# EAGLE design Mainsnode_v2_wifi (EAGLE 6.3)
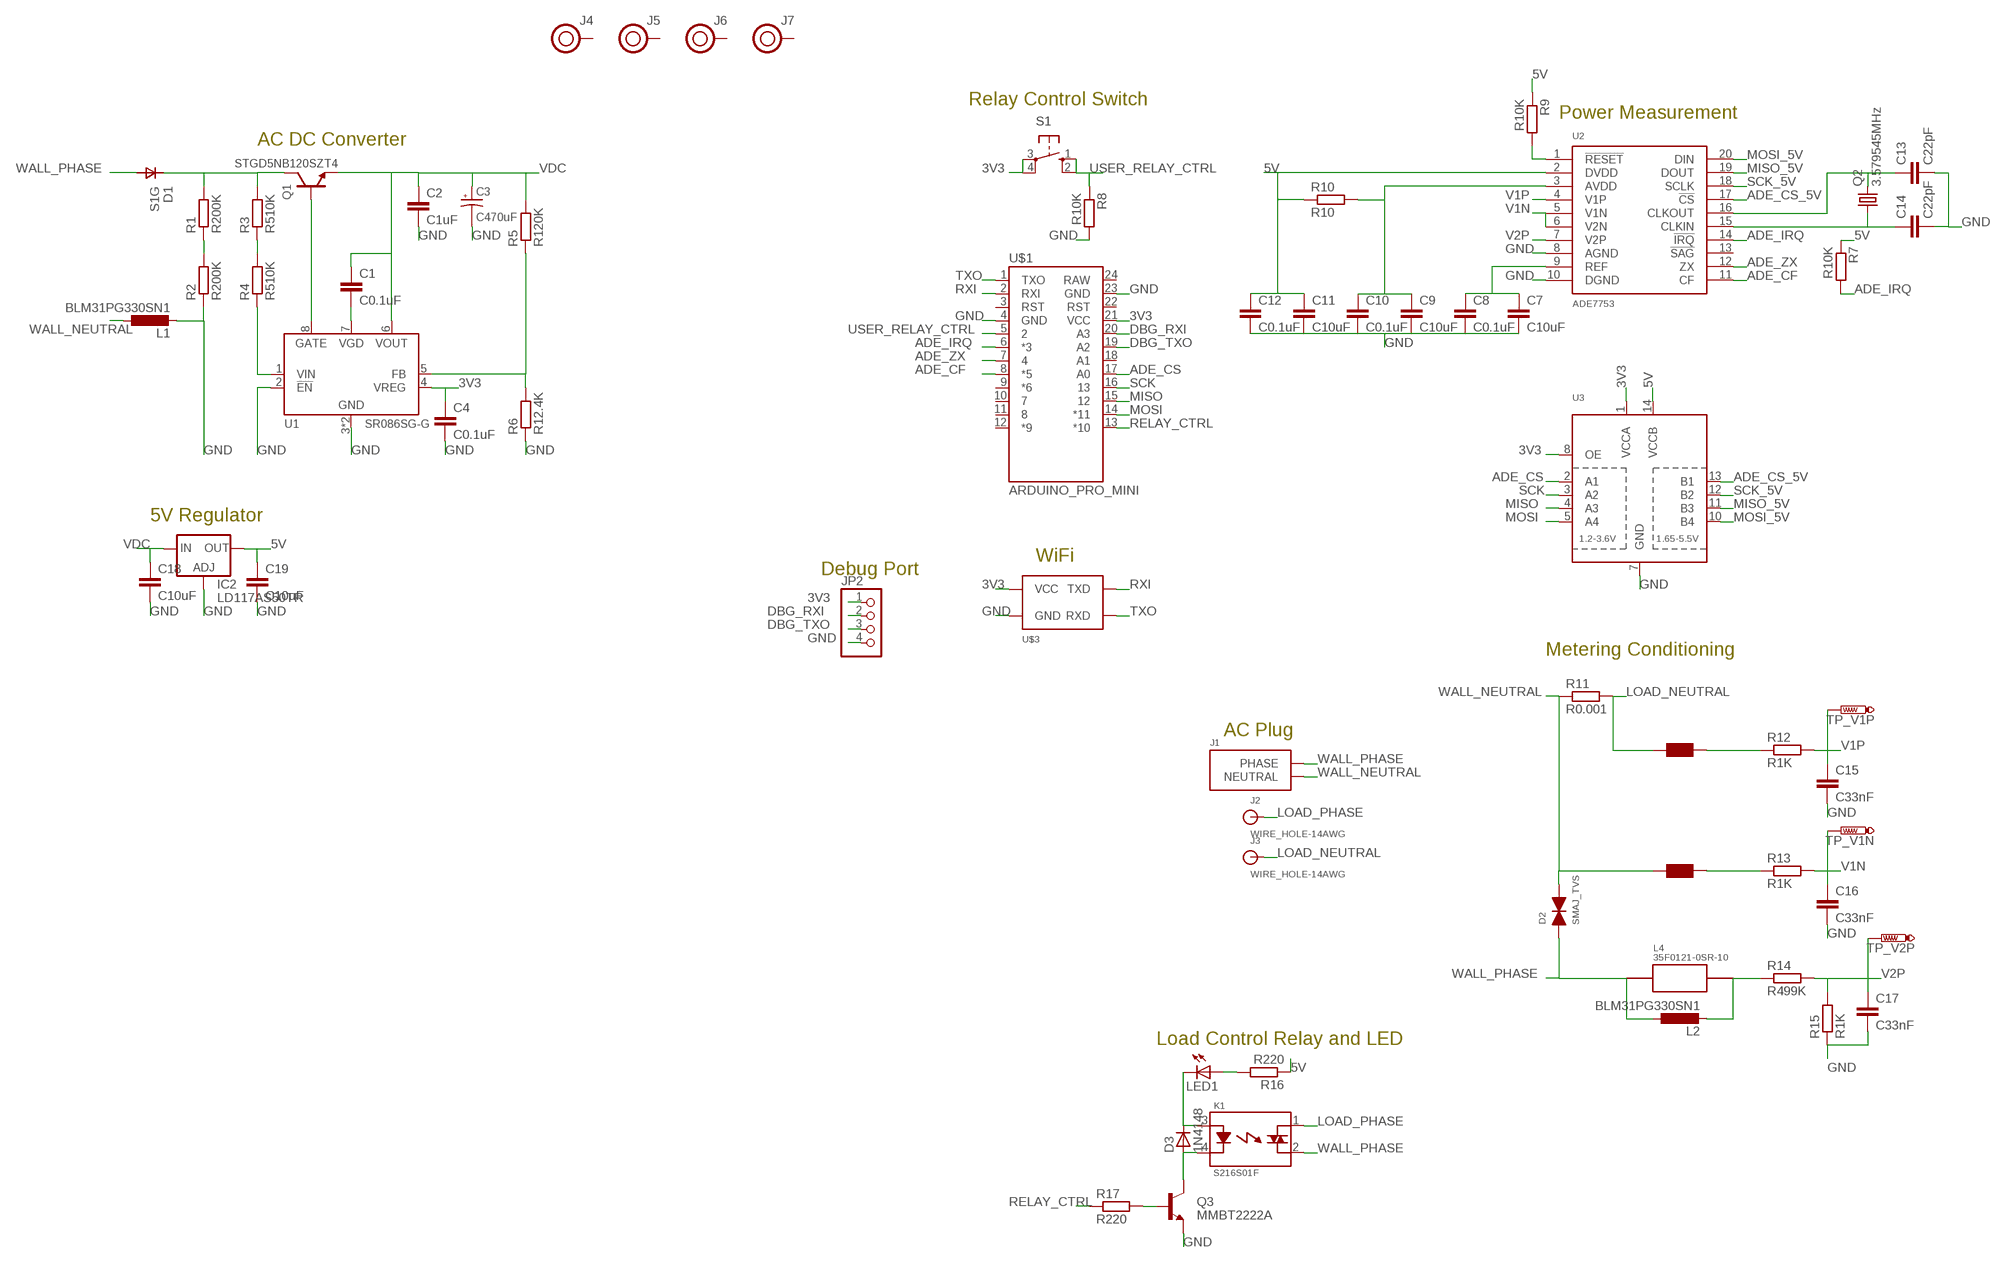
[diagram p0: schematic, sheet 1]

## Parts
C1  C0.1uF  C-EUC0805  [C0805]
C2  C1uF  C-EUC0805  [C0805]
C3  C470uF  CAP_EEE-FP1E471AP  [CAP_SM_10MM]
C4  C0.1uF  C-EUC0805  [C0805]
C7  C10uF  C-EUC0805  [C0805]
C8  C0.1uF  C-EUC0805  [C0805]
C9  C10uF  C-EUC0805  [C0805]
C10  C0.1uF  C-EUC0805  [C0805]
C11  C10uF  C-EUC0805  [C0805]
C12  C0.1uF  C-EUC0805  [C0805]
C13  C22pF  C-EUC0805  [C0805]
C14  C22pF  C-EUC0805  [C0805]
C15  C33nF  C-EUC0805  [C0805]
C16  C33nF  C-EUC0805  [C0805]
C17  C33nF  C-EUC0805  [C0805]
C18  C10uF  C-EUC0805  [C0805]
C19  C10uF  C-EUC0805  [C0805]
D1  S1G  [DO-214AC]
D2  SMAJ_TVS  [DO214_TVS]
D3  1N4148  D-SOD-80  [SOD80]
IC2  LD117AS50TR  [SOT223]
J1  AC-PLUG-2  [AC_MALE_PINS_2]
J2  WIRE_HOLE-14AWG  [WIRE_HOLE-14AWG]
J3  WIRE_HOLE-14AWG  [WIRE_HOLE-14AWG]
J4  HOLE  [HOLE-0.125]
J5  HOLE  [HOLE-0.125]
J6  HOLE  [HOLE-0.125]
J7  HOLE  [HOLE-0.125]
JP2  PINHD-1X4  [1X04]
K1  S216S01F  [RELAY_SX16S0X]
L1  BLM31PG330SN1  L-EUL3216C  [L3216C]
L2  BLM31PG330SN1  L-EUL3216C  [L3216C]
L4  35F0121-0SR-10  [35F0102]
LED1  LED3MM  [LED3MM]
Q1  STGD5NB120SZT4  [DPAK]
Q2  3.579545MHz  CRYSTALHC49S  [HC49/S]
Q3  MMBT2222A  TRANSISTOR_NPNMMBT2222A  [SOT23-3]
R1  R200K  R-EU_M0805  [M0805]
R2  R200K  R-EU_M0805  [M0805]
R3  R510K  R-EU_M0805  [M0805]
R4  R510K  R-EU_M0805  [M0805]
R5  R120K  R-EU_M0805  [M0805]
R6  R12.4K  R-EU_M0805  [M0805]
R7  R10K  R-EU_R0805  [R0805]
R8  R10K  R-EU_R0805  [R0805]
R9  R10K  R-EU_R0805  [R0805]
R10  R10  R-EU_R0805  [R0805]
R11  R0.001  R-EU_R2512  [R2512]
R12  R1K  R-EU_R0805  [R0805]
R13  R1K  R-EU_R0805  [R0805]
R14  R499K  R-EU_R0805  [R0805]
R15  R1K  R-EU_R0805  [R0805]
R16  R220  R-EU_R0805  [R0805]
R17  R220  R-EU_R0805  [R0805]
S1  10-XX  [B3F-10XX]
TP_V1N  PTR1PAD1-13  [P1-13]
TP_V1P  PTR1PAD1-13  [P1-13]
TP_V2P  PTR1PAD1-13  [P1-13]
U1  SR086SG-G  [SR086]
U2  ADE7753  [SSOP-20]
U3  TXB0104PWR  [TSSOP14]
U$1  ARDUINO_PRO_MINI  [ARDUINO_PRO_MINI]
U$3  ESP8266  [ESP8266]
U$4  BLM18BB151SN1  L0603  [L0603]
U$5  BLM18BB151SN1  L0603  [L0603]

## Nets
3V3: C4.1 JP2.1 S1.3(P) S1.4(P1) U1.4(VREG) U3.1(VCCA) U3.8(OE) U$1.21(VCC) U$3.VCC
5V: C11.1 C12.1 C19.1 IC2.4(OUT) R7.1 R9.1 R10.1 R16.1 U2.2(DVDD) U3.14(VCCB)
ADE_CF: U2.11(CF) U$1.8(*5)
ADE_CS: U3.2(A1) U$1.17(A0)
ADE_CS_5V: U2.17(!CS) U3.13(B1)
ADE_IRQ: R7.2 U2.14(!IRQ) U$1.6(*3)
ADE_ZX: U2.12(ZX) U$1.7
DBG_RXI: JP2.2 U$1.20(A3)
DBG_TXO: JP2.3 U$1.19(A2)
GND: C2.2 C3.- C4.2 C7.2 C8.2 C9.2 C10.2 C11.2 C12.2 C13.2 C14.2 C15.2 C16.2 C17.2 C18.2 C19.2 IC2.1(ADJ) JP2.4 L1.2 Q3.2(E) R2.1 R6.1 R8.2 R15.1 U1.2(!EN) U1.3(GND) U1.PAD(GND) U2.8(AGND) U2.10(DGND) U3.7(GND) U$1.4(GND) U$1.23(GND) U$3.GND
LOAD_NEUTRAL: J3.P$1 R11.2 U$4.1
LOAD_PHASE: J2.P$1 K1.1
MISO: U3.4(A3) U$1.15
MISO_5V: U2.19(DOUT) U3.11(B3)
MOSI: U3.5(A4) U$1.14(*11)
MOSI_5V: U2.20(DIN) U3.10(B4)
N$1: D1.CATHODE Q1.P$2(C) R1.2 R3.2
N$2: R1.1 R2.2
N$3: R3.1 R4.2
N$4: Q1.P$1(G) U1.8(GATE)
N$5: R4.1 U1.1(VIN)
N$6: C1.2 U1.7(VGD)
N$7: R5.1 R6.2 U1.5(FB)
N$8: LED1.A R16.2
N$9: R9.2 U2.1(!RESET)
N$10: C7.1 C8.1 U2.9(REF)
N$11: C14.1 Q2.1 U2.15(CLKIN)
N$12: C13.1 Q2.2 U2.16(CLKOUT)
N$13: C9.1 C10.1 R10.2 U2.3(AVDD)
N$14: R12.1 U$4.2
N$15: R13.1 U$5.2
N$16: D3.1(C) K1.3 LED1.K(C)
N$17: L2.2 L4.2 R14.1
N$18: D3.2(A) K1.4 Q3.3(C)
N$19: Q3.1(B) R17.2
RELAY_CTRL: R17.1 U$1.13(*10)
RXI: U$1.2(RXI) U$3.TXD
SCK: U3.3(A2) U$1.16
SCK_5V: U2.18(SCLK) U3.12(B2)
TXO: U$1.1(TXO) U$3.RXD
USER_RELAY_CTRL: R8.1 S1.1(S) S1.2(S1) U$1.5
V1N: C16.1 R13.2 TP_V1N.TP U2.5(V1N) U2.6(V2N)
V1P: C15.1 R12.2 TP_V1P.TP U2.4(V1P)
V2P: C17.1 R14.2 R15.2 TP_V2P.TP U2.7(V2P)
VDC: C1.1 C2.1 C3.+ C18.1 IC2.3(IN) Q1.P$3(E) R5.2 U1.6(VOUT)
WALL_NEUTRAL: D2.CATHODE J1.NEUTRAL1(NEUTRAL) J1.NEUTRAL2(NEUTRAL) L1.1 R11.1 U$5.1
WALL_PHASE: D1.ANNODE D2.ANODE J1.PHASE1(PHASE) J1.PHASE2(PHASE) K1.2 L2.1 L4.1
Unconnected: J4.1 J5.1 J6.1 J7.1 U2.13(!SAG) U$1.3(RST) U$1.9(*6) U$1.10 U$1.11 U$1.12(*9) U$1.18(A1) U$1.22(RST) U$1.24(RAW)

## Notes on the sheet
- Relay Control Switch
- Power Measurement
- AC DC Converter
- 5V Regulator
- WiFi
- Debug Port
- Metering Conditioning
- AC Plug
- Load Control Relay and LED

## Library data of the parts
C1 C2 C4 C7-C19 = resistor:C-EU: CAPACITOR, European symbol
C3 = powercube:CAP_EEE-FP1E471AP: Surface mount low ESR cap.; DIGIKEY: PCE4440CT-ND
D1 = powercube:S1G: Diode 400V 1A SMA; DIGIKEY: S1GFSCT-ND
D2 = powercube:SMAJ_TVS; DIGIKEY: SMAJ250CALFCT-ND
D3 = semicon-smd-ipc:D-: DIODE unfilled
IC2 = v-reg:LD117A?*: Low drop fixed and adjustable positive voltage regulators 1 A Source: http://www.st.com/stonline/products/literature/ds/7194/ld1117axx.pdf
J1 = powercube:AC-PLUG-2: For use with Bud Industries Box: 377-1709-ND
J2 J3 = powercube:WIRE_HOLE-14AWG: Solder point for 14AWG wire
J4-J7 = powercube:HOLE: 0.125" PCB Hole with ring
JP2 = pinhead:PINHD-1X4: PIN HEADER
K1 = powercube:S216S01F: RELAY SSR 240VAC 16A TRIAC 4-SIP; DIGIKEY: 425-2413-5-ND; MOUSER: 852-S216S01F; NEWARK: 14N9591
L1 L2 = resistor:L-EU: INDUCTOR, European symbol
L4 = powercube:35F0121-0SR-10: FERRITE 10A 42 OHMS @ 10 MHZ SMD; DIGIKEY: 240-2520-1-ND
LED1 = adafruit:LED: LED OSRAM: - CHIPLED LG R971, LG N971, LY N971, LG Q971, LY Q971, LO R971, LY R971 LH N974, LH R974 LS Q976, LO Q976, LY Q976 LO Q996 - Hyper CHIPLED LW Q18S LB Q993, LB Q99A, LB R99A - SideLED LS A670, LO A670, LY A670, LG A670, LP A670 LB A673, LV A673, LT A673, LW A673 LH A674 LY A675 LS A676, LA A676, LO A676, LY A676, LW A676 LS A679, LY A679, LG A679 - Hyper Micro SIDELED® LS Y876, LA Y876, LO Y876, LY Y876 LT Y87S - SmartLED LW L88C, LW L88S LB L89C, LB L89S, LG L890 LS L89K, LO L89K, LY L89K LS L896, LA L896, LO L896, LY L896 - TOPLED LS T670, LO T670, LY T670, LG T670, LP T670 LSG T670, LSP T670, LSY T670, LOP T670, LYG T670 LG T671, LOG T671, LSG T671 LB T673, LV T673, LT T673, LW T673 LH T674 LS T676, LA T676, LO T676, LY T676, LB T676, LH T676, LSB T676, LW T676 LB T67C, LV T67C, LT T67C, LS T67K, LO T67K, LY T67K, LW E67C LS E67B, LA E67B, LO E67B, LY E67B, LB E67C, LV E67C, LT E67C LW T67C LS T679, LY T679, LG T679 LS T770, LO T770, LY T770, LG T770, LP T770 LB T773, LV T773, LT T773, LW T773 LH T774 LS E675, LA E675, LY E675, LS T675 LS T776, LA T776, LO T776, LY T776, LB T776 LHGB T686 LT T68C, LB T68C - Hyper Mini TOPLED® LB M676 - Mini TOPLED Santana® LG M470 LS M47K, LO M47K, LY M47K Source: http://www.osram.convergy.de/
Q1 = powercube:STGD5NB120SZ: 5 A - 1200 V - low drop internally clamped IGBT; DIGIKEY: 497-4352-1-ND
Q2 = crystal:CRYSTAL: CRYSTAL; OC_FARNELL: 1667008; OC_NEWARK: unknown
Q3 = SparkFun-DiscreteSemi:TRANSISTOR_NPN: Generic NPN BJT MMBT2222A - TRANS-08049 (SOT-23, 1A 40V) MPSA42 - TRANS-09116 (SOT-23, 500mA 300V) MMBT5088LT1G - TRANS-11160 (SOT-23, 50 mA 30V) BC547 - COM-08928 <http://www.sparkfun.com/products/8928> (TO-92 45V 100mA) (1.Collector 2.Base 3.Emitter) 2N3904 - COM-00521 <http://www.sparkfun.com/products/521> (TO-92 40V 200mA) (1.Emitter 2.Base 3.Collector) P2N2222A - COM-12852 <http://www.sparkfun.com/products/12852> (TO-92 40V 600mA) (1.Collector 2.Base 3.Emitter); PROD_ID: TRANS-08049
R1-R17 = resistor:R-EU_: RESISTOR, European symbol
S1 = switch-omron:10-XX: OMRON SWITCH; MPN: B3F-1000; OC_FARNELL: 176432; OC_NEWARK: 36M3542
TP_V1N TP_V1P TP_V2P = testpad:PTR1: TEST PIN
U1 = powercube:SR086: Adjustable Off-Line Inductorless Switching Regulator; MOUSER: 689-SR086SG-G
U2 = powercube:ADE7753: Single-Phase Multifunction Metering IC; DIGIKEY: ADE7753ARSZRLCT-ND; MOUSER: 584-ADE7753ARSZR; NEWARK: 59K0984
U3 = adafruit:TXB0104PWR: 4-Bit Bi-Directional Level Shifter 1.2V-3.6V (VCCA) to 1.65V-5.5V (VCCB) bi-directional level shifter with auto direction sensing. Max data rate - VCCA 1.8V: 20Mbps (50ns), VCCA 3.3V: 100Mbps (10ns) Digikey: 296-21929-1-ND
U$1 = tigorcustom:ARDUINO_PRO_MINI
U$3 = tigorcustom:ESP8266
U$4 U$5 = tigorcustom:L0603

## Board
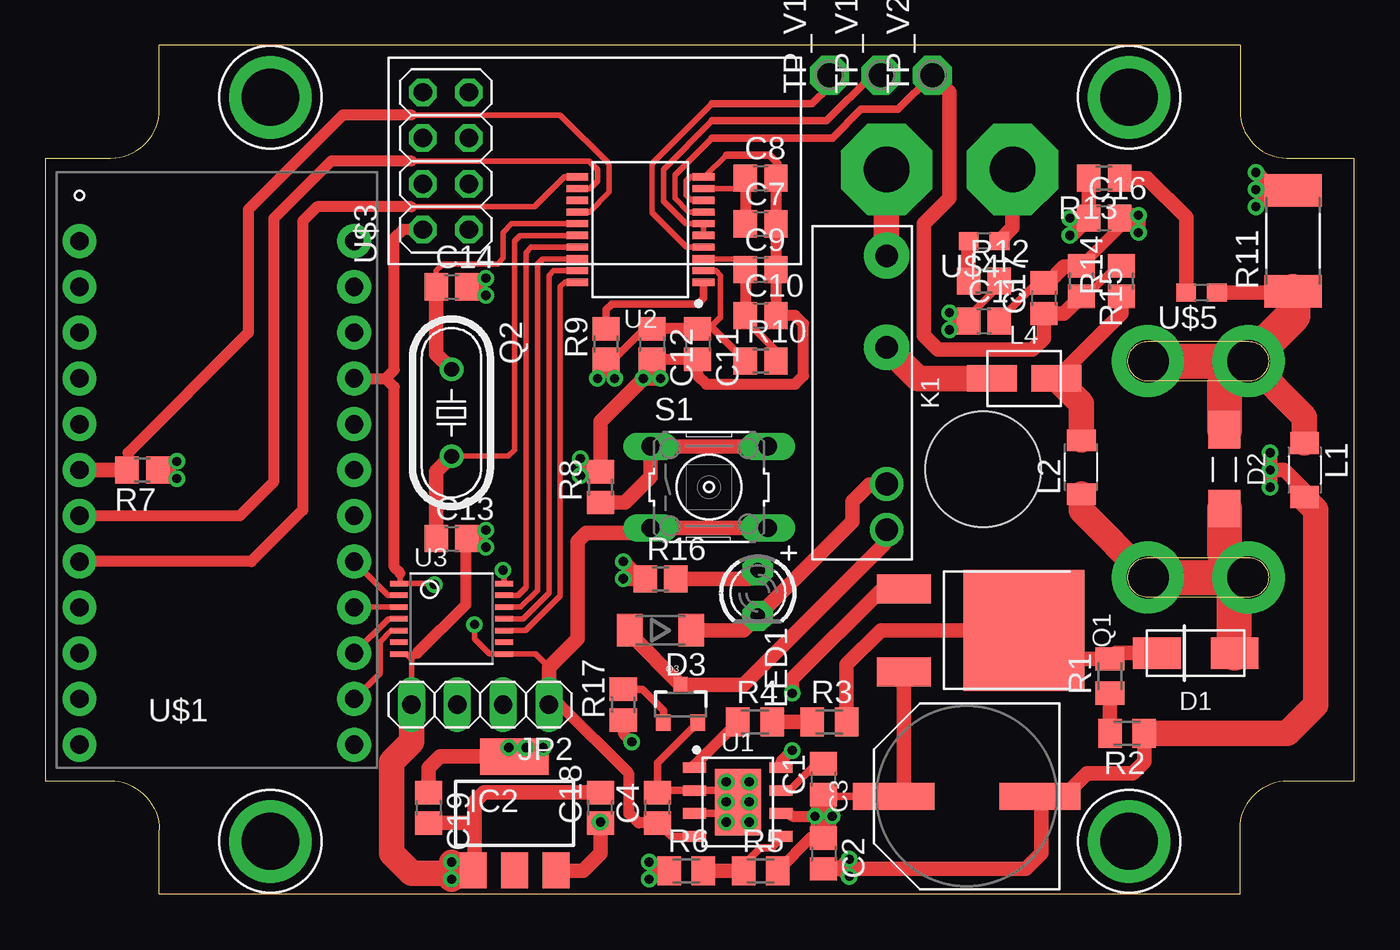
[diagram p1: board, top side]
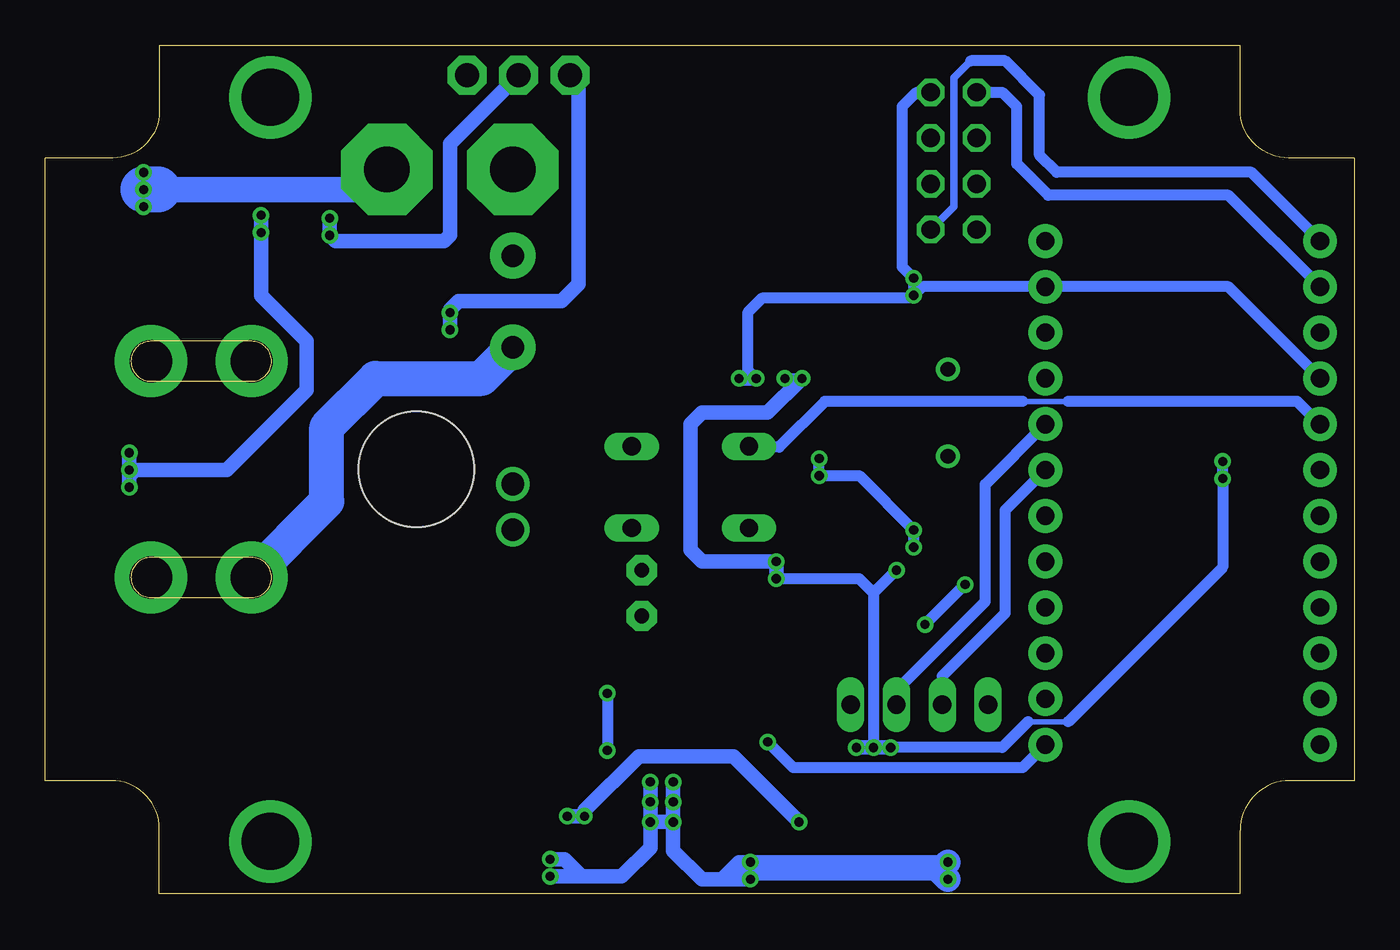
[diagram p2: board, bottom side, seen from below]

Size 72.62 x 47.07 mm. Coordinates in mm from the lower left corner, seen from the top.
Outline: 6.34,0 66.28,0 66.28,3.6 arc-90 68.94,6.26 72.62,6.26 72.62,40.8 68.87,40.8 arc-90 66.28,43.39 66.28,47.07 6.34,47.07 6.34,43.49 arc-90 3.65,40.8 0,40.8 0,6.26 3.58,6.26 arc-90 6.34,3.51 6.34,0
Copper layers (1*16): Top 0.035mm / dielectric 1.5mm / Bottom 0.035mm
Design rules "default": minimum track width 10mil, minimum drill 24mil, track to track 8mil, track to pad 8mil, pad to pad 8mil, via to via 8mil, smd to smd 8mil, copper to edge 40mil, drill to drill 8mil, minimum pad ring 10mil, minimum via ring 8mil, stop-mask expansion 4mil, vias tented up to drill 0mil, thermal gap 10mil

### Footprints (pad centres in the part's own frame; a part is rotated, then mirrored left to right if it is on the bottom)
C0805 = smd 1.3 x 1.5: 1 -0.85,0; 2 0.85,0
CAP_SM_10MM = smd 1.5 x 4.5: + 0,4.05; - 0,-4.05
DO-214AC = smd 2.65 x 1.75: ANNODE -2.15,0; CATHODE 2.15,0
DO214_TVS = smd 2.083 x 1.778: ANODE 2.184,0; CATHODE -2.184,0
SOD80 = smd 1.4 x 1.8: 1 -1.7,0; 2 1.7,0
SOT223 = smd 1.5 x 2: 1 -2.3,-3.15; 2 0,-3.15; 3 2.3,-3.15 | smd 3.8 x 2: 4 0,3.15
AC_MALE_PINS_2 = drill 2.34 pad 4: NEUTRAL1 -2.79,-5.995; NEUTRAL2 2.79,-5.995; PHASE1 -2.79,5.995; PHASE2 2.79,5.995 | hole 6.426: 11.938,0
WIRE_HOLE-14AWG = drill 2.54 pad 5.08 octagon: P$1 0,0
HOLE-0.125 = drill 3.175 pad 4.572: 1 0,0
1X04 = drill 1.016 long: 1 -3.81,0; 2 -1.27,0; 3 1.27,0; 4 3.81,0
RELAY_SX16S0X = drill 1.25 pad 2.54: 1 -7.602,0; 2 -2.522,0 | drill 1.25: 3 5.062,0; 4 7.602,0
L3216C = smd 1.2 x 1.6: 1 -1.5,0; 2 1.5,0
35F0102 = smd 2.769 x 1.473: 1 -1.791,0; 2 1.791,0
LED3MM = drill 0.813 pad 1.676 octagon: A -1.27,0; K 1.27,0
DPAK = smd 1.6 x 3: P$1 -2.3,-6.65; P$3 2.3,-6.65 | smd 6.7 x 6.7: P$2 0,0
HC49/S = drill 0.813: 1 -2.413,0; 2 2.413,0
SOT23-3 = smd 0.8 x 0.9: 1 -0.95,-1; 2 0.95,-1; 3 0,1.1
M0805 = smd 1.3 x 1.6: 1 -0.95,0; 2 0.95,0
R0805 = smd 1.3 x 1.5: 1 -0.85,0; 2 0.85,0
R2512 = smd 1.8 x 3.2: 1 -2.8,0; 2 2.8,0
B3F-10XX = drill 1.016 long: 1 -3.251,2.261; 2 3.251,2.261; 3 -3.251,-2.261; 4 3.251,-2.261
P1-13 = drill 1.321 pad 2.159 octagon: TP 0,0
SR086 = smd 1.27 x 0.6: 1 -2.4,1.905; 2 -2.4,0.635; 3 -2.4,-0.635; 4 -2.4,-1.905; 5 2.4,-1.905; 6 2.4,-0.635; 7 2.4,0.635; 8 2.4,1.905 | smd 2.55 x 3.7: PAD 0,0
SSOP-20 = smd 1.2 x 0.4: 1 -3.5,2.925; 2 -3.5,2.275; 3 -3.5,1.625; 4 -3.5,0.975; 5 -3.5,0.325; 6 -3.5,-0.325; 7 -3.5,-0.975; 8 -3.5,-1.625; 9 -3.5,-2.275; 10 -3.5,-2.925; 11 3.5,-2.925; 12 3.5,-2.275; 13 3.5,-1.625; 14 3.5,-0.975; 15 3.5,-0.325; 16 3.5,0.325; 17 3.5,0.975; 18 3.5,1.625; 19 3.5,2.275; 20 3.5,2.925
TSSOP14 = smd 0.305 x 0.991: 1 -1.95,-2.918; 2 -1.3,-2.918; 3 -0.65,-2.918; 4 0,-2.918; 5 0.65,-2.918; 6 1.3,-2.918; 7 1.95,-2.918; 8 1.95,2.918; 9 1.3,2.918; 10 0.65,2.918; 11 0,2.918; 12 -0.65,2.918; 13 -1.3,2.918; 14 -1.95,2.918
ARDUINO_PRO_MINI = drill 1.016 pad 1.88: 1 -7.62,12.7; 2 -7.62,10.16; 3 -7.62,7.62; 4 -7.62,5.08; 5 -7.62,2.54; 6 -7.62,0; 7 -7.62,-2.54; 8 -7.62,-5.08; 9 -7.62,-7.62; 10 -7.62,-10.16; 11 -7.62,-12.7; 12 -7.62,-15.24; 13 7.62,-15.24; 14 7.62,-12.7; 15 7.62,-10.16; 16 7.62,-7.62; 17 7.62,-5.08; 18 7.62,-2.54; 19 7.62,0; 20 7.62,2.54; 21 7.62,5.08; 22 7.62,7.62; 23 7.62,10.16; 24 7.62,12.7
ESP8266 = drill 1.016 octagon: 3 -1.27,-1.27; 4 -1.27,1.27; 5 1.27,-1.27; 6 1.27,1.27; GND 3.81,-1.27; RXD -3.81,-1.27; TXD 3.81,1.27; VCC -3.81,1.27
L0603 = smd 1.1 x 1: 1 -0.85,0; 2 0.85,0

### Placement (x,y rotation side)
C1  43.18,6.35 90 top
C2  43.18,2.22 270 top
C3  51.12,5.4 90 top
C4  33.97,4.76 90 top
C7  39.69,37.15 0 top
C8  39.69,39.69 0 top
C9  39.69,34.61 0 top
C10  39.69,32.07 0 top
C11  36.2,30.48 270 top
C12  33.66,30.48 270 top
C13  22.54,19.68 0 top
C14  22.54,33.66 0 top
C15  52.07,31.75 0 top
C16  58.74,37.47 0 top
C17  55.4,33.02 90 top
C18  30.8,4.76 90 top
C19  21.27,4.76 270 top
D1  63.82,13.34 180 top
D2  65.41,23.53 270 top
D3  34.13,14.61 180 top
IC2  26.04,4.45 0 top
J1  63.96,23.53 180 top
J2  46.67,40.16 0 top
J3  53.66,40.16 0 top
J4  12.5,44.17 0 top
J5  60.12,44.17 0 top
J6  12.5,2.9 0 top
J7  60.12,2.9 0 top
JP2  24.13,10.48 180 top
K1  46.67,27.78 270 top
L1  69.85,23.5 270 top
L2  57.47,23.65 90 top
L4  54.29,28.57 0 top
LED1  39.53,16.67 270 top
Q1  54.29,14.61 270 top
Q2  22.54,26.67 270 top
Q3  35.24,10.48 0 top
R1  59.05,12.06 90 top
R2  60.01,8.89 180 top
R3  43.5,9.53 0 top
R4  39.37,9.53 0 top
R5  39.69,1.27 0 top
R6  35.56,1.27 0 top
R7  5.4,23.5 180 top
R8  30.8,22.54 90 top
R9  31.11,30.48 90 top
R10  39.69,29.53 0 top
R11  69.22,36.2 90 top
R12  52.07,33.97 0 top
R13  58.74,39.69 180 top
R14  59.69,33.97 90 top
R15  57.47,33.97 270 top
R16  34.13,17.46 0 top
R17  32.07,10.48 90 top
S1  36.83,22.54 0 top
TP_V1N  46.35,45.4 90 top
TP_V1P  43.5,45.4 90 top
TP_V2P  49.21,45.4 90 top
U1  38.42,5.08 0 top
U2  33.02,36.83 180 top
U3  22.54,15.24 270 top
U$1  9.53,23.5 0 top
U$3  22.23,40.64 90 top
U$4  52.07,36.2 180 top
U$5  64.14,33.34 180 top

### Tracks (layer width: path | path; a pad name or v marks a point on that pad's centre or on a via)
3V3  (via drill 0.51)
  Top 0.305: 27.94,12.54 27.19,13.29 U3.8 24.65,13.29 23.81,14.13 v23.81,14.92 | U3.1 19.68,17.19 | 19.68,17.78 19.68,17.25 U3.1 | U3.1 21.55,17.19 v21.59,17.14
  Top 0.406: U1.4 34.71,3.17 C4.1
  Top 0.61: U$1.21 18.89,28.57 | 18.89,28.57 19.37,29.05 19.37,36.35 19.84,36.83 U$3.VCC | 19.68,17.78 19.37,18.1 19.37,28.1 18.89,28.57 | C4.1 32.92,3.91 32.38,4.45 32.38,6.67 28.57,10.48 JP2.1
  Top 0.813: JP2.1 27.94,12.54 29.53,14.13 29.53,19.53 30,20 33.18,20 33.46,20.28 S1.3 S1.4
  Bottom 0.61: v23.81,14.92 v21.59,17.14
5V  (via drill 0.51)
  Top 0.305: U2.2 37.2,34.55 37.47,34.29 37.47,31.96 36.83,31.33 | U3.14 25.46,17.88 v25.4,17.94
  Top 0.406: C11.1 36.83,31.33 37.03,31.33 R10.1 | R9.1 31.54,29.63 33.18,31.27 33.6,31.27 C12.1
  Top 0.61: C11.1 C12.1 | v25.72,8.1 25.72,7.91 IC2.4 | v30.64,28.57 31.11,29.05 | 31.11,29.05 R9.1 | 31.11,29.05 v31.59,28.57 | R7.1 6.83,23.5 | 6.83,23.5 v7.3,23.97 | v7.3,23.02 6.83,23.5
  Top 0.813: C19.1 21.27,6.99 21.91,7.62 26.01,7.62 IC2.4 | v32.07,18.41 33.02,17.46 R16.1 v32.07,17.46
  Bottom 0.305: 15.88,9.53 18.1,9.53
  Bottom 0.61: v25.4,17.94 26.67,16.67 | 26.67,16.67 v26.67,8.1 | 26.67,16.67 27.46,17.46 v32.07,17.46 | v31.59,28.57 v30.64,28.57 30.48,28.57 | v7.3,23.97 v7.3,23.02 7.3,18.1 15.88,9.53 | 18.1,9.53 19.53,8.1 v25.72,8.1
  Bottom 0.813: v25.72,8.1 v26.67,8.1 v27.62,8.1 | v32.07,17.46 v32.07,18.41 36.2,18.41 36.83,19.05 36.83,26.04 36.2,26.67 32.54,26.67 v30.64,28.57
ADE_CF
  Top 0.305: U2.11 28.8,39.76 27.15,38.1 20.32,38.1
  Top 0.61: U$1.8 11.43,18.41 14.29,21.27 14.29,37.31 15.08,38.1 20.32,38.1
ADE_CS
  Top 0.305: U3.2 19.02,16.54 U$1.17
ADE_CS_5V
  Top 0.305: U3.13 26.22,16.54 26.67,16.99 26.67,35.56 26.96,35.85 U2.17
ADE_IRQ
  Top 0.305: U2.14 30.18,37.8 31.27,38.89 31.27,40.48 28.57,43.18 20.32,43.18
  Top 0.61: R7.2 4.6,23.55 4.6,24.45 11.27,31.11 11.27,37.94 16.51,43.18 20.32,43.18
  Top 0.813: U$1.6 R7.2
ADE_ZX
  Top 0.305: 20.32,40.64 30.16,40.64 30.64,40.16 30.64,39.53 30.21,39.1 U2.12
  Top 0.61: U$1.7 10.79,20.95 12.7,22.86 12.7,37.47 15.88,40.64 20.32,40.64
DBG_RXI
  Bottom 0.61: U$1.20 20.48,22.7 20.48,16.19 25.4,11.27 JP2.2
DBG_TXO
  Bottom 0.61: U$1.19 19.37,21.27 19.37,15.56 22.86,12.06 JP2.3
GND  (via drill 0.51)
  Top 0.305: 20.32,13.02 20.05,13.29 U3.7 | 20.32,13.02 JP2.4 | U2.8 35.84,38.45 35.56,38.73 35.56,39.53 35.79,39.76 U2.10 36.58,39.76 37.78,40.96 | 20.32,13.02 20.64,13.34
  Top 0.406: U1.3 37.78,4.45 U1.PAD 37.78,5.71 U1.2 34.08,5.71 C4.2 33.97,7.26 Q3.2 | 37.78,40.96 40.16,40.96 40.64,40.48 40.64,39.79 | C15.2 52.92,31.81 54.93,33.81 55.35,33.81 C17.2
  Top 0.61: 40.64,39.79 C8.2 C7.2 C9.2 C10.2 41.59,32.07 42.07,31.59 42.07,28.73 41.59,28.26 36.67,28.26 36.2,28.73 C11.2 C12.2 33.66,29.05 | C16.2 59.59,36.94 R15.1 | 23.97,19.68 v24.45,20.16 | 23.97,19.68 C13.2 23.34,19.63 23.34,16.03 20.64,13.34 | 23.97,19.68 v24.45,19.21 | R8.2 30.42,23.39 | 30.42,23.39 v29.69,24.13 | 30.42,23.39 29.9,23.39 v29.69,23.18 | 33.66,29.05 v33.18,28.57 | 33.66,29.05 v34.13,28.57
  Top 0.813: C18.2 24.34,5.61 23.81,5.08 23.81,3.81 | 23.81,3.81 23.81,1.37 IC2.1 23.28,1.75 23.28,1.53 23.18,1.43 22.86,1.43 v22.54,1.75 | C19.2 23.71,3.91 23.81,3.81 | R6.1 33.97,1.27 | 33.97,1.27 v33.5,1.75 | v33.5,0.79 33.97,1.27 | v37.78,6.19 37.78,5.71 | v44.61,1.91 44.13,1.43 | 44.13,1.43 43.24,1.43 C2.2 54.4,1.37 55.24,2.22 55.24,5.32 C3.- 56.52,5.4 57.78,6.67 60.33,6.67 60.96,7.3 R2.1 61.59,8.89 | v44.61,0.95 44.13,1.43 | C17.2 55.62,33.87 56.52,34.77 57.41,34.77 R15.1 | v67.94,24.45 v67.94,23.5 | v67.94,23.5 v67.94,22.54 | L1.2 69.85,22.38 68.74,23.5 v67.94,23.5 | v60.64,36.67 v60.64,37.62 59.75,37.62 C16.2 | v34.13,28.57 v33.18,28.57 30.8,26.19 R8.2 | C14.2 23.97,33.66 | 23.97,33.66 v24.45,34.13 | v24.45,33.18 23.97,33.66
  Top 1.422: L1.2 69.85,21.91 70.48,21.27 70.48,10.48 68.9,8.89 61.59,8.89 | v22.54,1.75 v22.54,0.79 22.23,1.11 20.32,1.11 19.21,2.22 19.21,7.3 20.32,8.41 JP2.4
  Bottom 0.61: v33.5,1.75 33.5,1.43 | U$1.4 6.99,33.66 U$1.23 23.97,33.66 v24.45,33.18 | U$3.GND 24.29,44.45 25.08,43.66 25.08,34.77 v24.45,34.13 v24.45,33.18 | v24.45,19.21 v24.45,20.16 27.46,23.18 v29.69,23.18 v29.69,24.13 | v24.45,33.18 24.45,33.02 32.86,33.02 33.66,32.23 33.66,29.05 v33.18,28.57
  Bottom 0.813: v37.78,3.97 37.78,2.38 36.2,0.79 35.08,0.79 | 35.08,0.79 v33.5,0.79 | v33.5,1.75 34.13,1.75 35.08,0.79 | v37.78,3.97 v37.78,5.08 v37.78,6.19 | v37.78,3.97 v39.05,3.97 | v39.05,3.97 v39.05,5.08 v39.05,6.19 | v39.05,3.97 39.05,2.54 40.64,0.95 42.86,0.95 | 42.86,0.95 v44.61,0.95 | v44.61,1.91 43.81,1.91 42.86,0.95 | v60.64,37.62 60.64,33.18 58.1,30.64 58.1,27.94 62.55,23.5 67.63,23.5 67.79,23.34 67.94,23.34 v67.94,22.54 | v67.94,23.5 v67.94,24.45 | v33.18,28.57 v34.13,28.57
  Bottom 1.422: v22.54,0.79 23.18,1.43 | 23.18,1.43 33.5,1.43 33.97,1.43 | 23.18,1.43 22.86,1.43 v22.54,1.75
LOAD_NEUTRAL  (via drill 0.51)
  Top 0.813: J3.P$1 53.66,36.93 U$4.1 | R11.2 68.16,38.99 v67.15,40.01 | v67.15,39.05 69.16,39.05 R11.2 | v67.15,38.1 68.05,38.99 R11.2
  Bottom 1.422: J3.P$1 54.77,39.05 66.36,39.05
  Bottom 2.54: 66.36,39.05 v67.15,39.05
LOAD_PHASE
  Top 1.422: J2.P$1 K1.1
MISO
  Top 0.305: U3.4 19.05,15.24 U$1.15
MISO_5V
  Top 0.305: U3.11 26.51,15.24 27.94,16.67 27.94,34.29 28.2,34.55 U2.19
MOSI
  Top 0.305: U3.5 19.19,14.59 18.57,13.97 18.57,12.22 U$1.14
MOSI_5V
  Top 0.305: U3.10 26.66,14.59 28.57,16.51 28.57,33.66 28.82,33.91 U2.20
N$1
  Top 0.813: D1.CATHODE 59.38,13.34 R1.2 55.88,13.02 Q1.P$2 46.35,14.61 44.45,12.7 R3.2
N$2
  Top 0.813: R1.1 R2.2
N$3
  Top 0.813: R4.2 R3.1
N$4  (via drill 0.51)
  Top 0.61: U1.8 40.82,7.32 v41.43,7.94
  Top 0.813: Q1.P$1 46.43,16.91 41.43,11.91 v41.43,11.11
  Bottom 0.61: v41.43,11.11 v41.43,7.94
N$5
  Top 0.61: U1.1 36.02,7.12 R4.1
N$6
  Top 0.406: U1.7 41.27,5.71 42.55,6.99 42.97,6.99 C1.2
N$7
  Top 0.406: R5.1 38.74,1.59 39.69,2.54 40.32,2.54 40.82,3.04 U1.5
  Top 0.813: R5.1 R6.2
N$8
  Top 0.813: R16.2 39.05,17.46 LED1.A
N$9
  Top 0.406: U2.1 36.52,33.03 36.2,32.7 31.43,32.7 31.11,32.38 R9.2
N$10
  Top 0.305: U2.9 38.26,39.1 C8.1
  Top 0.61: C8.1 C7.1
N$11
  Top 0.305: U2.15 25.88,37.16 25.4,36.67 25.4,35.24 25.08,34.92 22.07,34.92 21.69,34.55 C14.1
  Top 0.813: C14.1 21.69,29.93 Q2.1
N$12
  Top 0.305: Q2.2 25.69,24.26 26.04,24.61 26.04,36.2 26.34,36.51 U2.16
  Top 0.813: C13.1 21.69,23.41 Q2.2
N$13
  Top 0.305: U2.3 38.24,35.2 C9.1
  Top 0.406: C10.1 38.84,31.81 40.48,30.16 40.48,29.58 R10.2
  Top 0.61: C9.1 C10.1
N$14
  Top 0.813: U$4.2 R12.1
N$15
  Top 0.813: U$5.2 63.28,37.52 61.12,39.69 R13.1
N$16
  Top 0.813: D3.1 38.73,14.61 LED1.K 44.77,20.64 44.77,21.75 45.72,22.7 46.65,22.7 K1.3
N$17
  Top 0.813: R14.1 59.69,32.18 L4.2
  Top 1.422: L2.2 57.47,27.19 L4.2
N$18
  Top 0.813: K1.4 46.51,20.02 46.51,19.37 38.72,11.58 Q3.3 32.43,14.39 D3.2
N$19
  Top 0.406: R17.2 33.12,11.33 34.29,10.16 Q3.1
RELAY_CTRL  (via drill 0.51)
  Top 0.61: R17.1 32.07,8.89 v32.54,8.41
  Bottom 0.61: U$1.13 18.41,6.99 31.11,6.99 v32.54,8.41
RXI
  Bottom 0.61: U$3.TXD 19.53,44.45 18.73,43.66 18.73,40.48 16.99,38.73 6.99,38.73 U$1.2
SCK
  Top 0.305: U3.3 17.16,15.89 U$1.16
SCK_5V
  Top 0.305: U3.12 26.37,15.89 27.3,16.83 27.3,34.92 27.59,35.2 U2.18
TXO
  Bottom 0.406: 21.27,46.2 22.23,45.24 22.23,38.1 U$3.RXD
  Bottom 0.61: U$1.1 5.71,40.01 16.51,40.01 17.46,40.96 17.46,44.29 19.37,46.2 21.27,46.2
USER_RELAY_CTRL
  Top 0.813: S1.2 S1.1 33.58,23.1 32.17,21.69 R8.1
  Bottom 0.305: 15.88,27.3 18.41,27.3
  Bottom 0.61: U$1.5 3.17,27.3 15.88,27.3 | 18.41,27.3 29.37,27.3 31.91,24.77 33.54,24.77 S1.1
V1N  (via drill 0.51)
  Top 0.305: U2.5 U2.6 35.55,37.16 34.29,38.42 34.29,40.16 36.99,42.86
  Top 0.406: TP_V1N.TP 45.88,45.4 43.34,42.86 36.99,42.86
  Top 0.813: R13.2 C16.1 | v56.83,37.47 C16.1 | v56.83,36.51 56.94,36.51 C16.1
  Bottom 0.813: TP_V1N.TP 50.16,41.59 50.16,36.51 50.48,36.2 56.52,36.2 v56.83,36.51 v56.83,37.47
V1P  (via drill 0.51)
  Top 0.305: U2.4 35.58,35.85 33.66,37.78 33.66,40.48 36.99,43.81
  Top 0.406: 36.99,43.81 42.55,43.81 43.5,44.77 TP_V1P.TP | R12.2 52.92,33.71 51.44,32.23 51.44,31.96 C15.1
  Top 0.61: v50.16,32.23 50.64,31.75 | v50.16,31.27 50.64,31.75 | 50.64,31.75 C15.1
  Bottom 0.813: TP_V1P.TP 43.02,44.93 43.02,33.81 43.97,32.86 49.69,32.86 50.16,32.38 v50.16,31.27
V2P
  Top 0.305: U2.7 35.7,37.8 34.92,38.58 34.92,39.85 36.99,41.91
  Top 0.406: TP_V2P.TP 47.31,43.5 45.24,43.5 43.66,41.91 36.99,41.91 | R15.2 57.73,33.12 59.21,34.61 59.48,34.61 R14.2
  Top 0.813: R15.2 56.52,32.17 C17.1 55.4,30.8 54.77,30.16 49.53,30.16 48.74,30.96 48.74,37.15 50.16,38.58 50.16,44.45 TP_V2P.TP
VDC  (via drill 0.51)
  Top 0.406: C3.+ 43.28,5.4 C1.1 | 43.18,3.65 43.18,3.81 v43.66,4.29 | C18.1 v30.8,3.97
  Top 0.61: R5.2 42.55,3.17 43.08,3.17 C2.1 | U1.6 41.27,4.45 41.43,4.29 v42.7,4.29
  Top 0.813: Q1.P$3 47.64,5.97 C3.+ | IC2.3 28.36,1.27 29.84,1.27 30.8,2.22 C18.1 | C2.1 43.18,3.65
  Top 1.422: 43.28,5.4 43.18,5.29 43.18,3.65
  Bottom 0.813: v43.66,4.29 v42.7,4.29 42.7,4.6 39.69,7.62 34.45,7.62 v30.8,3.97
WALL_NEUTRAL
  Top 0.813: U$5.1 69.16,33.34 R11.1
  Top 1.422: L1.1 69.85,26.43 J1.NEUTRAL1
  Top 1.93: J1.NEUTRAL2 J1.NEUTRAL1 | J1.NEUTRAL1 66.68,29.53 65.41,28.26 D2.CATHODE | J1.NEUTRAL1 66.75,29.6 69.22,32.07 R11.1
WALL_PHASE
  Top 1.422: L4.1 48.4,28.57 K1.2 | L2.1 57.47,21.24 J1.PHASE2
  Top 1.93: D2.ANODE 65.41,18.88 J1.PHASE1 | J1.PHASE2 J1.PHASE1 | D1.ANNODE 65.97,16.76 J1.PHASE1
  Bottom 1.93: J1.PHASE2 61.17,17.57 56.99,21.75 56.99,25.88 54.29,28.57 48.4,28.57 K1.2